# Altium schematic sheet Weatstone bridges part II.SchDoc: Weatstone bridges part II
size A4; Revision: 1; SheetNumber: 6; SheetTotal: 6
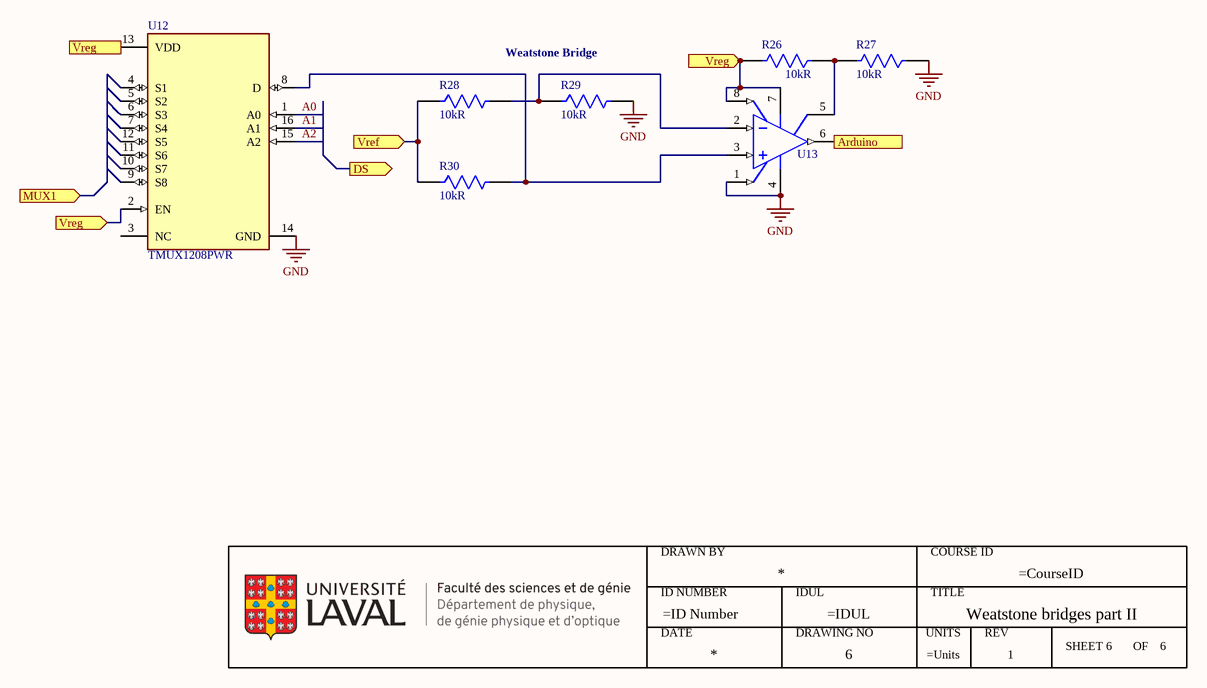
[diagram p0: Weatstone bridges part II.SchDoc]

## Parts
*5  ULaval FSG-DPGPO  (value not drawn)
R26  value 10kR  [FP-RT0603-IPC_C]  (hidden comment: RT0603BRD0710KL)
R27  value 10kR  [FP-RT0603-IPC_C]  (hidden comment: RT0603BRD0710KL)
R28  value 10kR  [FP-RT0603-IPC_C]  (hidden comment: RT0603BRD0710KL)
R29  value 10kR  [FP-RT0603-IPC_C]  (hidden comment: RT0603BRD0710KL)
R30  value 10kR  [FP-RT0603-IPC_C]  (hidden comment: RT0603BRD0710KL)
U12  TMUX1208PWR  [FP-PW0016A-IPC_B]
U13  MCP6N11-100E/SN  [SOIC-SN8_L]  (value not drawn)

## Ports
Arduino (out), DS (out), MUX1 (in), Vref (in), Vreg (in)

## Nets
GND: R27.1 R29.2 U12.14(GND) U13.1(VFG) U13.4(VSS)
A0: U12.1(A0)
A1: U12.16(A1)
A2: U12.15(A2)
Arduino: U13.6(VOUT) ; port Arduino
Vref: R28.1 R30.1 ; port Vref
Vreg: R26.2 U12.2(EN) U12.13(VDD) U13.7(VDD) U13.8(EN/~{CAL}) ; port Vreg
NetR26_1: R26.1 R27.2 U13.5(VREF)
NetR28_2: R28.2 R29.1 U13.2(VIM)
NetR30_2: R30.2 U12.8(D) U13.3(VIP)

Not connected (* = marked no-connect by the designer): U12 3(NC) 4(S1) 5(S2) 6(S3) 7(S4) 9(S8) 10(S7) 11(S6) 12(S5)

## Notes on the sheet
- Weatstone Bridge
- (in symbol ULaval FSG-DPGPO) DRAWN BY; COURSE ID; ID NUMBER; IDUL; TITLE; DATE; DRAWING NO; UNITS; REV; SHEET; OF

## Library data of the parts
R26-R30 = CMP-009-00178-1: Res High precision Thin Film 0603 10K Ohm 0.1% 1/10W ±25ppm/°C Molded SMD Paper T/R; Max Power Dissipation: 100mW; Working Voltage: 75V; RoHS Compliant: Yes; Power Rating: 100mW; Lead Free: Lead Free; Depth: 0.8mm; Case Code (Imperial): 0603; Max Operating Temperature: 155°C; Voltage Rating: 75V; Package Quantity: 5000; Packaging: Tape and Reel; Case/Package: 0603; Height: 0.022inch; Construction: Rectangular; Min Operating Temperature: -55°C; Termination: SMD/SMT; Features: Moisture Resistant; Number of Terminations: 2; Case Code (Metric): 1608; Technology: THIN FILM; Military Standard: Not; Length: 0.063inch; Voltage Rating (DC): 75V; Temperature Coefficient: 25ppm/°C; Weight: 7.1E-05oz; Width: 0.8mm; Series: RT; Resistor Type: Thin Film
U12 = CMP-015-00012-1: 5-V, 8: 1, 1-channel general-purpose analog multiplexer with 1.8-V input logic 16-TSSOP -40 to 125; RoHS Compliant: Yes
U13 = CMP-014-00010-1: MCP6N11 Series Single Channel 500 KHz 5.5 V Instrumentation Amplifier - SOIC-8; Bandwidth: 500kHz; Min Supply Voltage: 1.8V; Number of Elements: 2; Gain Bandwidth Product: 35MHz; Input Offset Voltage (Vos): 350uV; Number of Channels: 1; Nominal Supply Current: 800uA; Common Mode Rejection Ratio: 86dB; Slew Rate: 6V/µs; Max Supply Voltage: 5.5V; Slew Rate-Nom: 9V/µs; Input Bias Current: 10pA; Mounting Technology: Surface Mount; Package Quantity: 100; Pins: 8; Width: 3.9mm; Length: 4.9mm; Case/Package: SOIC; Min Operating Temperature: -40°C; Radiation Hardening: No; RoHS Compliant: Yes; Unity Gain Bandwidth Product: 35MHz; Lead Free: Lead Free; Number of Amplifiers: 1; Max Operating Temperature: 125°C; Height: 1.25mm; Packaging: Rail/Tube; Input Offset Voltage-Max: 350uV; Reach SVHC Compliant: Yes; Supply Current: 800uA; Max Supply Current: 800uA; Power Supply Rejection Ratio (PSRR): 86dB; Number of Circuits: 1